# Altium project Larix_EDUV3b.PrjPcb
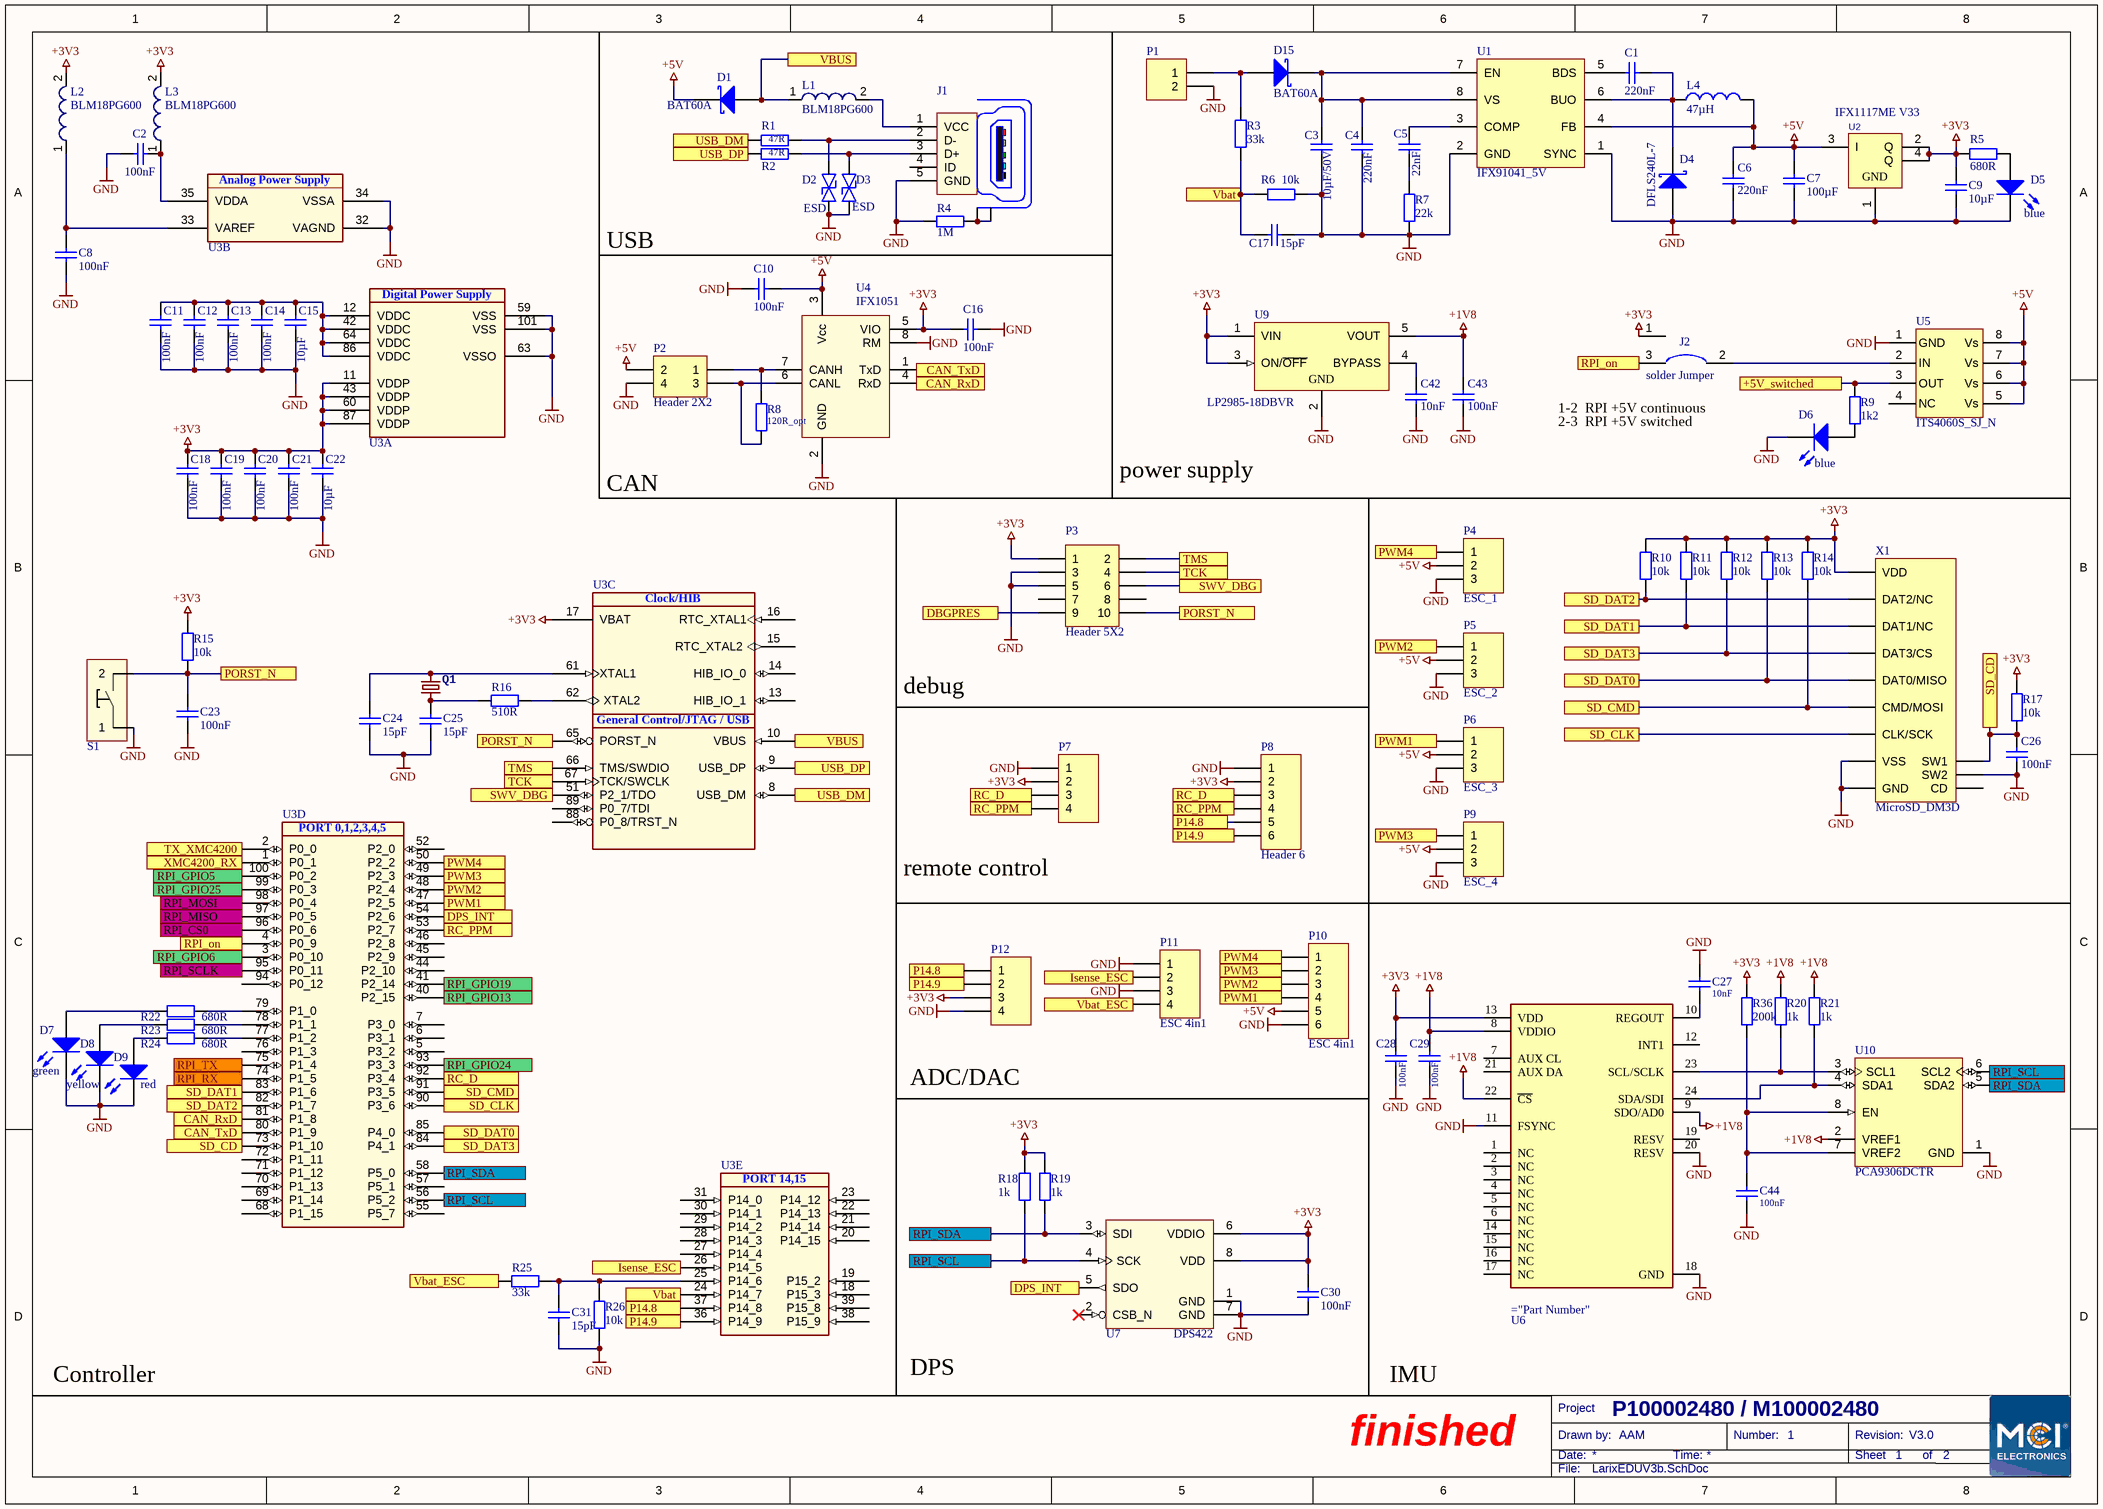
[diagram p0: LarixEDUV3b.SchDoc]
myProjectName: P100002480 / M100002480; myStatus: finished
2 sheets, 132 parts. Net scope: flat (ports and power ports of the same name join across sheets).
Board file: LarixEDUV3b.PcbDoc
Sheets:
  LarixEDUV3b.SchDoc
  LarixEDUV3b_1.SchDoc

## Sheet LarixEDUV3b.SchDoc: Larix EDU V2a
size A3; DrawnBy: AAM; Organization: MCI; DocumentNumber: 1; Revision: V3.0; SheetNumber: 1; SheetTotal: 2; ProjectName: M10000760

### Parts
C1  220nF  [_0603]
C2  100nF  [_0603]
C3  10µF/50V  [_1210]
C4  220nF  [_0603]
C5  22nF  [_0603]
C6  220nF  [_0603]
C7  100µF  [_1210]
C8  100nF  [_0603]
C9  10µF  [_0603]
C10  100nF  [_0603]
C11  100nF  [_0603]
C12  100nF  [_0603]
C13  100nF  [_0603]
C14  100nF  [_0603]
C15  10µF  [_0603]
C16  100nF  [_0603]
C17  15pF  [_0603]
C18  100nF  [_0603]
C19  100nF  [_0603]
C20  100nF  [_0603]
C21  100nF  [_0603]
C22  10µF  [_0603]
C23  100nF  [_0603]
C24  15pF  [_0603]
C25  15pF  [_0603]
C26  100nF  [_0603]
C27  10nF  [_0603]
C28  100nF  [_0603]
C29  100nF  [_0603]
C30  100nF  [_0603]
C31  15pF  [_0603]
C42  10nF  [_0603]
C43  100nF  [_0603]
C44  100nF  [_0603]
D1  BAT60A  [SOD-323]
D2  ESD  [TSLP_2_17]
D3  ESD  [TSLP_2_17]
D4  DFLS240L-7  [PowerDI_123]
D5  blue  [LED_0603]
D6  blue  [LED_0603]
D7  green  [LED_0603]
D8  yellow  [LED_0603]
D9  red  [LED_0603]
D15  BAT60A  [SOD-323]
J1  629105150921  [629105150921]  (value not drawn)
J2  solder Jumper  [Jumper_3pol]
L1  BLM18PG600  [SMD 0603]
L2  BLM18PG600  [SMD 0603]
L3  BLM18PG600  [SMD 0603]
L4  47µH  [WE_TCP]
P1  WRTBL_2P_508  [WRTBL_2P_508]  (value not drawn)
P2  Header 2X2  [HDR2X2]
P3  Header 5X2  [FTSH-105-01-F-D-K]
P4  ESC_1  [HDR1X3]
P5  ESC_2  [HDR1X3]
P6  ESC_3  [HDR1X3]
P7  STJ_SH_4pol  [SM04B-SRSS-TB(LF)(SN)]  (value not drawn)
P8  Header 6  [HDR1X6]
P9  ESC_4  [HDR1X3]
P10  ESC 4in1  [SM06B-SRSS-TB(LF)(SN)]
P11  ESC 4in1  [SM04B-SRSS-TB(LF)(SN)]
P12  STJ_SH_4pol  [SM04B-SRSS-TB(LF)(SN)]  (value not drawn)
Q1  12MHZ/S/3.2X2.5  [32X25_4PAD]  (value not drawn)
R1  47R  [_0603]
R2  47R  [_0603]
R3  33k  [_0603]
R4  1M  [_0603]
R5  680R  [_0603]
R6  10k  [_0603]
R7  22k  [_0603]
R8  120R_opt  [_0603]
R9  1k2  [_0603]
R10  10k  [_0603]
R11  10k  [_0603]
R12  10k  [_0603]
R13  10k  [_0603]
R14  10k  [_0603]
R15  10k  [_0603]
R16  510R  [_0603]
R17  10k  [_0603]
R18  1k  [_0603]
R19  1k  [_0603]
R20  1k  [_0603]
R21  1k  [_0603]
R22  680R  [_0603]
R23  680R  [_0603]
R24  680R  [_0603]
R25  33k  [_0603]
R26  10k  [_0603]
R36  200k  [_0603]
S1  Pushbutton_B3U-1000P  [B3U-1000P]  (value not drawn)
U1  IFX91041_5V  [DSO_8]
U2  IFX1117ME V33  [INF-PG-SOT223_SC-73_N]
U3  XMC4700-F100K2048  [QFP50P1600X1600X160-101N]  (value not drawn)  (parts A,B,C,D,E of 5)
U4  IFX1051  [PG-TSON-8]
U5  ITS4060S_SJ_N  [SO_8]
U6  ICM-20948  [TDK_InvenSense_ICM-20948_0]  (value not drawn)
U7  DPS422  [DPS310]
U9  LP2985-18DBVR  [DBV0005A_M]
U10  PCA9306DCTR  [DCT0008A_L]
X1  MicroSD_DM3D  [MicroSD_DM3D]

### Ports
+5V_switched, CAN_RxD, CAN_TxD, DBGPRES, DPS_INT, Isense_ESC, P14.8, P14.9, PORST_N, PWM1, PWM2, PWM3, PWM4, RC_D, RC_PPM, RPI_CS0, RPI_GPIO5, RPI_GPIO6, RPI_GPIO13, RPI_GPIO19, RPI_GPIO24, RPI_GPIO25, RPI_MISO, RPI_MOSI, RPI_on, RPI_RX (out), RPI_SCL, RPI_SCLK, RPI_SDA, RPI_TX (in), SD_CD, SD_CLK, SD_CMD, SD_DAT0, SD_DAT1, SD_DAT2, SD_DAT3, SWV_DBG, TCK, TMS, TX_XMC4200 (in), USB_DM, USB_DP, Vbat, Vbat_ESC, VBUS, XMC4200_RX (out)

### Nets
+1V8: C29.1 C43.1 R20.2 R21.2 U6.8(VDDIO) U6.9(SDO/AD0) U6.22(~{CS}) U9.5(VOUT) U10.2(VREF1)
+3V3: C9.2 C16.1 C18.1 C19.1 C20.1 C21.1 C22.1 C28.1 C30.1 J2.1 L2.2 L3.2 P3.1 P7.2 P8.2 P12.3 R5.1 R10.2 R11.2 R12.2 R13.2 R14.2 R15.2 R17.2 R18.2 R19.2 R36.2 U2.2(Q) U2.4(Q) U3.11(VDDP) U3.17(VBAT) U3.43(VDDP) U3.60(VDDP) U3.87(VDDP) U4.5(VIO) U6.13(VDD) U7.6(VDDIO) U7.8(VDD) U9.1(VIN) U9.3(ON/~{OFF}) X1.4(VDD)
+5V: C6.1 C7.2 C10.2 D1.1(K) L4.2 P2.2 P4.2 P5.2 P6.2 P9.2 P10.5 U1.4(FB) U2.3(I) U4.3(Vcc) U5.5(Vs) U5.6(Vs) U5.7(Vs) U5.8(Vs)
GND: C2.1 C3.1 C4.2 C6.2 C7.1 C8.2 C9.1 C10.1 C11.2 C12.2 C13.2 C14.2 C15.2 C16.2 C17.1 C18.2 C19.2 C20.2 C21.2 C22.2 C23.2 C24.1 C25.2 C26.2 C27.1 C28.2 C29.2 C30.2 C31.2 C42.2 C43.2 C44.2 D2.1 D3.1 D4.1(A) D5.2 D6.2 D7.2 D8.2 D9.2 J1.5(GND) P1.2 P2.4 P3.3 P3.5 P4.3 P5.3 P6.3 P7.1 P8.1 P9.3 P10.6 P11.1 P11.3 P12.4 R4.1 R6.2 R7.1 R26.1 S1.1 U1.1(SYNC) U1.2(GND) U2.1(GND) U3.32(VAGND) U3.34(VSSA) U3.59(VSS) U3.63(VSSO) U3.101(VSS) U4.2(GND) U4.8(RM) U5.1(GND) U6.11(FSYNC) U6.18(GND) U6.20(RESV) U7.1(GND) U7.7(GND) U9.2(GND) U10.1(GND) X1.6(VSS) X1.GND X1.SW2
NetC1_1: C1.1 U1.5(BDS)
NetC1_2: C1.2 D4.2(K) L4.1 U1.6(BUO)
NetC2_2: C2.2 L3.1 U3.35(VDDA)
NetC3_2: C3.2 C4.1 D15.1(K) U1.7(EN) U1.8(VS)
NetC5_1: C5.1 U1.3(COMP)
NetC5_2: C5.2 R7.2
NetC8_1: C8.1 L2.1 U3.33(VAREF)
NetC11_1: C11.1 C12.1 C13.1 C14.1 C15.1 U3.12(VDDC) U3.42(VDDC) U3.64(VDDC) U3.86(VDDC)
NetC17_2: C17.2 R3.1 R6.1 U3.24(P14_7) ; port Vbat
NetC23_1: C23.1 P3.10 R15.1 S1.2 U3.65(PORST_N) ; port PORST_N
NetC24_2: C24.2 Q1.1 U3.61(XTAL1)
NetC25_1: C25.1 Q1.3 R16.2
NetC26_1: C26.1 R17.1 U3.73(P1_10) X1.SW1 ; port SD_CD
NetC27_2: C27.2 U6.10(REGOUT)
NetC31_1: C31.1 R25.2 R26.2 U3.25(P14_6)
NetC42_1: C42.1 U9.4(BYPASS)
NetC44_1: C44.1 R36.1 U10.7(VREF2) U10.8(EN)
NetD1_2: D1.2(A) L1.1 U3.10(VBUS) ; port VBUS
NetD2_2: D2.2 J1.2(D-) R1.2
NetD3_2: D3.2 J1.3(D+) R2.2
NetD5_1: D5.1 R5.2
NetD6_1: D6.1 R9.1
NetD7_1: D7.1 R22.2
NetD8_1: D8.1 R23.2
NetD9_1: D9.1 R24.2
NetD15_2: D15.2(A) P1.1 R3.2
NetJ1_1: J1.1(VCC) L1.2
NetJ1_Z1: J1.Z1(Shield) J1.Z2(Shield) R4.2
NetJ2_2: J2.2 U5.2(IN)
NetJ2_3: J2.3 U3.4(P0_9) ; port RPI_on
NetP2_1: P2.1 R8.2 U4.7(CANH)
NetP2_3: P2.3 R8.1 U4.6(CANL)
NetP3_2: P3.2 U3.66(TMS/SWDIO) ; port TMS
NetP3_4: P3.4 U3.67(TCK/SWCLK) ; port TCK
NetP3_6: P3.6 U3.51(P2_1/TDO) ; port SWV_DBG
NetP3_9: P3.9 ; port DBGPRES
NetP4_1: P4.1 P10.1 U3.50(P2_2) ; port PWM4
NetP5_1: P5.1 P10.3 U3.48(P2_4) ; port PWM2
NetP6_1: P6.1 P10.4 U3.47(P2_5) ; port PWM1
NetP7_3: P7.3 P8.3 U3.92(P3_4) ; port RC_D
NetP7_4: P7.4 P8.4 U3.53(P2_7) ; port RC_PPM
NetP8_5: P8.5 P12.1 U3.37(P14_8) ; port P14.8
NetP8_6: P8.6 P12.2 U3.36(P14_9) ; port P14.9
NetP9_1: P9.1 P10.2 U3.49(P2_3) ; port PWM3
NetP11_2: P11.2 U3.26(P14_5) ; port Isense_ESC
NetP11_4: P11.4 R25.1 ; port Vbat_ESC
NetP13_2: R9.2 U5.3(OUT) ; port +5V_switched
NetP13_3: R19.1 U3.58(P5_0) U7.3(SDI) U10.5(SDA2) ; port RPI_SDA
NetP13_5: R18.1 U3.56(P5_2) U7.4(SCK) U10.6(SCL2) ; port RPI_SCL
NetP13_8: U3.75(P1_4) ; port RPI_TX
NetP13_10: U3.74(P1_5) ; port RPI_RX
NetP13_18: U3.93(P3_3) ; port RPI_GPIO24
NetP13_19: U3.98(P0_4) ; port RPI_MOSI
NetP13_21: U3.97(P0_5) ; port RPI_MISO
NetP13_22: U3.99(P0_3) ; port RPI_GPIO25
NetP13_23: U3.95(P0_11) ; port RPI_SCLK
NetP13_24: U3.96(P0_6) ; port RPI_CS0
NetP13_29: U3.100(P0_2) ; port RPI_GPIO5
NetP13_31: U3.3(P0_10) ; port RPI_GPIO6
NetP13_33: U3.40(P2_15) ; port RPI_GPIO13
NetP13_35: U3.41(P2_14) ; port RPI_GPIO19
NetR1_1: R1.1 U3.8(USB_DM) ; port USB_DM
NetR2_1: R2.1 U3.9(USB_DP) ; port USB_DP
NetR10_1: R10.1 U3.82(P1_7) X1.1(DAT2/NC) ; port SD_DAT2
NetR11_1: R11.1 U3.83(P1_6) X1.8(DAT1/NC) ; port SD_DAT1
NetR12_1: R12.1 U3.84(P4_1) X1.2(DAT3/CS) ; port SD_DAT3
NetR13_1: R13.1 U3.85(P4_0) X1.7(DAT0/MISO) ; port SD_DAT0
NetR14_1: R14.1 U3.91(P3_5) X1.3(CMD/MOSI) ; port SD_CMD
NetR16_1: R16.1 U3.62(XTAL2)
NetR20_1: R20.1 U6.23(SCL/SCLK) U10.3(SCL1)
NetR21_1: R21.1 U6.24(SDA/SDI) U10.4(SDA1)
NetR22_1: R22.1 U3.79(P1_0)
NetR23_1: R23.1 U3.78(P1_1)
NetR24_1: R24.1 U3.77(P1_2)
NetU3_1: U3.1(P0_1) ; port XMC4200_RX
NetU3_2: U3.2(P0_0) ; port TX_XMC4200
NetU3_54: U3.54(P2_6) U7.5(SDO) ; port DPS_INT
NetU3_80: U3.80(P1_9) U4.1(TxD) ; port CAN_TxD
NetU3_81: U3.81(P1_8) U4.4(RxD) ; port CAN_RxD
NetU3_90: U3.90(P3_6) X1.5(CLK/SCK) ; port SD_CLK

Not connected (* = marked no-connect by the designer): J1 4(ID); P3 7 8; U3 5(P3_2) 6(P3_1) 7(P3_0) 13(HIB_IO_1) 14(HIB_IO_0) 15(RTC_XTAL2) 16(RTC_XTAL1) 18(P15_3) 19(P15_2) 20(P14_15) 21(P14_14) 22(P14_13) 23(P14_12) 27(P14_4) 28(P14_3) 29(P14_2) 30(P14_1) 31(P14_0) 38(P15_9) 39(P15_8) 44(P2_10) 45(P2_9) 46(P2_8) 52(P2_0) 55(P5_7) 57(P5_1) 68(P1_15) 69(P1_14) 70(P1_13) 71(P1_12) 72(P1_11) 76(P1_3) 88(P0_8/TRST_N) 89(P0_7/TDI) 94(P0_12); U5 4(NC); U6 1(NC) 2(NC) 3(NC) 4(NC) 5(NC) 6(NC) 7(AUX_CL) 12(INT1) 14(NC) 15(NC) 16(NC) 17(NC) 19(RESV) 21(AUX_DA); U7 2(CSB_N)*; X1 CD

### Notes on the sheet
- USB
- (near J2) 1-2  RPI +5V continuous
- (near J2) 2-3  RPI +5V switched
- CAN
- power supply
- debug
- (near P7) remote control
- ADC/DAC
- Controller
- DPS
- IMU
- Project
- Date:
- Drawn by:
- Time:
- Number:
- Revision:
- Sheet
- of
- ELECTRONICS
- File:
- (in symbol IC_116, part A) Digital Power Supply
- (in symbol IC_116, part B) Analog Power Supply
- (in symbol IC_116, part C) Clock/HIB; General Control/JTAG / USB
- (in symbol IC_116, part D) PORT 0,1,2,3,4,5
- (in symbol IC_116, part E) PORT 14,15

### Library data of the parts
C1 C2 C4-C6 C8-C31 C42-C44 = Cap_129: Name: Cap_0603; QR: 0; UID: Cap_129; mounting: SMD
C3 C7 = Cap_65: Name: Cap_1210; Capacity: ?F; Voltage: ?V; UID: Cap_65; mounting: SMD
D1 D15 = BAT60A: Silicon AF Schottky Rectifier Diode with Extreme Low VF Drop; Published: 21-Mar-2003; LatestRevisionDate: 19-Mar-2004; LatestRevisionNote: Silkscreen size reduced.; DatasheetDocument: Jan-1999; PackageDocument: Sep-2000; PackageReference: SOD-323; Publisher: Altium Limited; ComponentLink1Description: Manufacturer Link; ComponentLink1URL: http://www.infineon.com/; ComponentLink2Description: Datasheet; ComponentLink2URL: http://www.infineon.com/upload/Document/cmc_upload/documents/081/715/bat60aseries_1.pdf
D2 D3 = DIODE_69: ESD101-B1-02ELS _E6327; UID: DIODE_69; Name: ESD; mounting: SMD
D4 = DIODE_68: Type: Schottky; UID: DIODE_68; Name: DFLS240L-7; mounting: SMD
D5-D9 = DIODE_61: Name: LED_0603_gruen; Colour: gruen; RS_number: 697-3715P; QR: 0; UID: DIODE_61; Type: LED; Name_Hyperlink: http://at.rs-online.com/web/p/products/6973715P/; mounting: SMD
J1 = 629105150921: WR-COM_USB_Micro Type AB_Horizontal_SMT; Manufacturer: Würth Elektronik eiSos GmbH; ComponentLink1 Description: Manufacturer; ComponentLink2 Description: Datasheet; NoPins: 5; ComponentLink1URL: http://www.we-online.de; ComponentLink2URL: http://katalog.we-online.de/em/datasheet/629105150921.pdf; Created by: Karrer Zheng; Created Date: 10/23/2014; partNo: 629105150921
J2 = Con_71: UID: Con_71; Name: Jumper_3pol; mounting: SMD
L1-L3 = WE-CBF 0603, 74279260: SMD EMI Suppression Ferrite Beads WE-CBF, Z= 40 Ohm; Manufacturer: Würth Elektronik eiSos GmbH; Impedance: 40 Ohm; ComponentLink1Description: Manufacturer; ComponentLink1URL: http://www.we-online.de; Created by: Christin Zierenner; Created Date: May 2009; partNo: 74279260; ComponentLink2Description: Datasheet; ComponentLink2URL: http://www.we-online.de/katalog/media/pdf/74279260.pdf
L4 = Ind_42: Inductor; Name: IND_4u7_1A72; RS_number: 617-0925; Wuerth_number: 744042004; QR: 0; Inductivity: 4u7; Current: 1.72; UID: Ind_42; Name_Hyperlink: http://at.rs-online.com/web/p/drahtgewickelte-smd-induktivitaten/6170925/; ComponentLink1URL: http://at.rs-online.com/web/p/drahtgewickelte-smd-induktivitaten/6170925/; mounting: SMD
P1 = Con_7: RS_number: 193-0586; QR: 0; UID: Con_7; Name: WRTBL_2P_508; Name_Hyperlink: Printklemme 5,08mm 2-polig; ComponentLink1URL: http://at.rs-online.com/web/search/searchBrowseAction.html?method=getProduct&R=1930586; mounting: THT; Pins: 2
P2 = Con_45: QR: 0; UID: Con_45; Name: Header 2X2; mounting: THT; Pins: 2X2
P3 = Header 5X2: Header, 5-Pin, Dual row; LatestRevisionDate: 17-Jul-2002; LatestRevisionNote: Re-released for DXP Platform.; Publisher: Altium Limited
P4-P6 P9 = Con_33: QR: 0; UID: Con_33; Name: Header 3; mounting: THT; Pins: 1X3
P7 P12 = Con_80: UID: Con_80; Name: STJ_SH_4pol; mounting: SMD
P8 = Con_36: QR: 0; UID: Con_36; Name: Header 6; mounting: THT; Pins: 1X6
P10 = Con_82: Name: STJ_SH_06pol; UID: Con_82; mounting: SMD
P11 = Con_80: Name: STJ_SH_4pol; UID: Con_80; mounting: SMD
Q1 = NX3225_2
R1-R26 R36 = Res_5: Name: Res_0603; UID: Res_5; mounting: SMD
  R5 R9-R14 R17: ComponentLink1URL: #WERT!
S1 = Misc_47: RS_number: 419-867; UID: Misc_47; Name: Pushbutton_B3U-1000P; Name_Hyperlink: https://at.rs-online.com/web/p/products/419867; ComponentLink1URL: https://at.rs-online.com/web/p/products/419867; mounting: SMD
U1 = Source_52: UID: Source_52; Name: IFX91041; mounting: SMD
U2 = IFX1117ME V33: Voltage Regulator, 4.55 to 15 V Operating, 1000 mA, -40 to 125 degC, PG-SOT223 (SC-73), Reel, Green; Manufacturer: Infineon; Accuracy: 2.0 %; Automotive Qualified: FALSE; Dropout Voltage: 1200 mV; Green: TRUE; Max Number Reflow: 3; Max Peak Reflow Temp: 260 degC; Max. Output Current: 1000 mA; Output Voltage: 3.3 V; Regulator Type: Linear->single output; Typical Quiescent Current: 5000 uA; DatasheetVersion: Rev. 1.0; PackageVersion: Apr-08; PackageReference: PG-SOT223 (SC-73); PackageDescription: 4-Pin Small Outline Transistor Package, 6.5 x 3.5 mm Body, 2.3 mm Pitch; Supplier 1: Mouser; Supplier Part Number 1: 726-IFX1117MEV33; Supplier 2: Digi-Key; Supplier Part Number 2: IFX1117ME V33TR-ND; Supplier 3: Digi-Key; Supplier Part Number 3: IFX1117ME V33CT-ND; Supplier 4: Digi-Key; Supplier Part Number 4: IFX1117ME V33DKR-ND; MSL: 1; Packing: Reel; Reset: FALSE; Status Output: FALSE; Mounting Technology: Surface Mount; PartNumber: IFX1117ME V33; ComponentLink1Description: Manufacturer URL; ComponentLink1URL: http://www.infineon.com/; ComponentLink2Description: Datasheet; ComponentLink2URL: http://www.infineon.com/dgdl/IFX1117ME+V33.pdf?folderId=db3a304318f3fe290118f5a433570040&fileId=db3a30432e779412012e9097d1611987; ComponentLink3Description: Package Specification; ComponentLink3URL: http://www.infineon.com/dgdl/SOT223-Package_Overview.pdf?folderId=db3a30431936bc4b0119530470b03c3d&fileId=db3a30431936bc4b0119531d40b93c5c
U3 = IC_116: XMC4000 Family Microcontroller for Industrial Applications, ARM® Cortex™-M4, 32-bit processor coreFlash 2048 Kbytes,SRAM 352 Kbytes (Temperature Range -40°C to 125°C); Manufacturer: Infineon Technologies; ManufacturerPartNumber: XMC4700-F100K2048; PackageReference: PG-LQFP-100-11; UID: IC_116; Name: XMC4700-F100K2048; mounting: SMD
U4 = IC_117: UID: IC_117; Name: IFX1051; mounting: SMD
U5 = IC_102: RS_number: 110-7158; UID: IC_102; Name: ITS4060S_SJ_N; Name_Hyperlink: https://at.rs-online.com/web/p/intelligente-leistungsschalter/1107158/?searchTerm=ITS4060S-SJ-N&relevancy-data=636F3D3226696E3D4931384E4B6E6F776E41734D504E266C753D6465266D6D3D6D61746368616C6C7061727469616C26706D3D5E5B5C707B4C7D5C707B4E647D2D2C2F255C2E5D2B; ComponentLink1URL: https://at.rs-online.com/web/p/intelligente-leistungsschalter/1107158/?searchTerm=ITS4060S-SJ-N&relevancy-data=636F3D3226696E3D4931384E4B6E6F776E41734D504E266C753D6465266D6D3D6D61746368616C6C7061727469616C26706D3D5E5B5C707B4C7D5C707B4E647D2D2C2F255C2E5D2B; IC_description: https://www.infineon.com/dgdl/Infineon-ITS4060S_SJ_N_01092012S-DS-v01_00-en.pdf?fileId=db3a304339dcf4b1013a0137d230573b; mounting: SMD
U7 = IC_107: Digital Barometric Pressure Sensor for Portable Devices; Manufacturer: Infineon Technologies; ManufacturerPartNumber: DPS310; PackageReference: LGA-8; UID: IC_107; Name: DPS422; mounting: SMD
U9 = LP2985-18DBVR: Single Output Low Noise LDO, 150 mA, Fixed 1.8 V Output, 1.5% Tolerance, 2.2 to 16 V Input, Low IQ, 5-Pin SOT-23 (DBV), -40 to 125 degC, Green (RoHS & no Sb/Br), Tape and Reel; Manufacturer: Texas Instruments; Vdo (Typ) (mV): 280; Output Options: Fixed Output; Iout (Max) (A): 0.15; Fixed Output Options (V): 1.8; Iq (Typ) (mA): 0.85; Accuracy (%): 1.5; Operating Temperature Range (degC): -40 to 125; PartNumber: LP2985-18DBVR; ComponentLink1Description: Manufacturer URL; ComponentLink2Description: Datasheet; DatasheetVersion: SLVS522N; ComponentLink3URL: http://www.ti.com/litv/pdf/mpds018j; ComponentLink1URL: http://www.ti.com/; Packing: Tape and Reel; ComponentLink2URL: http://www.ti.com/lit/ds/symlink/lp2985-50.pdf; ComponentLink3Description: Package Specification; PackageVersion: 4073253-4/L; RoHS: TRUE; Mounting Technology: Surface Mount; PackageReference: DBV0005A; PackageDescription: 5-Pin Plastic Small Outline, Body 2.9 x 1.6 mm, Pitch 0.95 mm; Vin (V): 2.2 to 16
U10 = PCA9306DCTR: Dual Bi-Directional I2C-Bus and SMBus Voltage Level-Translator, 0 to 5.5 V, -40 to 85 degC, 8-pin SM8 (DCT), Green (RoHS & no Sb/Br); Manufacturer: Texas Instruments; SubFamily: I2C Special Function; Function: Voltage Translator; fSCLK(Max)(MHz): 400; Open Drain I/O Type: Yes; No. of Outputs: 2; Vcc range(V): 0 to 5.5; Rating: Catalog; tpd max(ns): 1.5; Eco-Plan: Green (RoHS & no Sb/Br); PartNumber: PCA9306DCTR; ComponentLink1Description: Datasheet; ComponentLink2Description: Package Specification; ComponentLink1URL: http://www.ti.com/general/docs/lit/getliterature.tsp?genericPartNumber=PCA9306&fileType=pdf; Code_JEDEC: MO-187-DA; ComponentLink2URL: http://www.ti.com/litv/pdf/mpds049b; Enable Pin: Yes; 5V Tolerant I/O: Yes; On-Chip Power-on-Reset: No; PackageVersion: revC, Sep-2002; Max Frequency(kHz): 400; DatasheetVersion: SCPS113J; Mounting Technology: Surface Mount; PackageReference: DCT0008A; PackageDescription: 8-Pin Thin Small Outline Package 3 x 2.8 mm Body ,0.65 mm Pitch
X1 = Misc_48: CONN MICRO SD CARD PUSH-PUSH R/A; RS_number: 738-8809; Supplier 1: Digi-Key; Supplier Part Number 1: 101-00660-68-6-1-ND; UID: Misc_48; Name: MicroSD_DM3D; Name_Hyperlink: https://at.rs-online.com/web/p/speicher-und-sim-karten-steckverbinder/7388809/; mounting: SMD

## Sheet LarixEDUV3b_1.SchDoc: Larix EDU V3
size A3; DrawnBy: AAM; Organization: MCI; DocumentNumber: 1; Revision: V3.0; SheetNumber: 2; SheetTotal: 2; ProjectName: M10000760
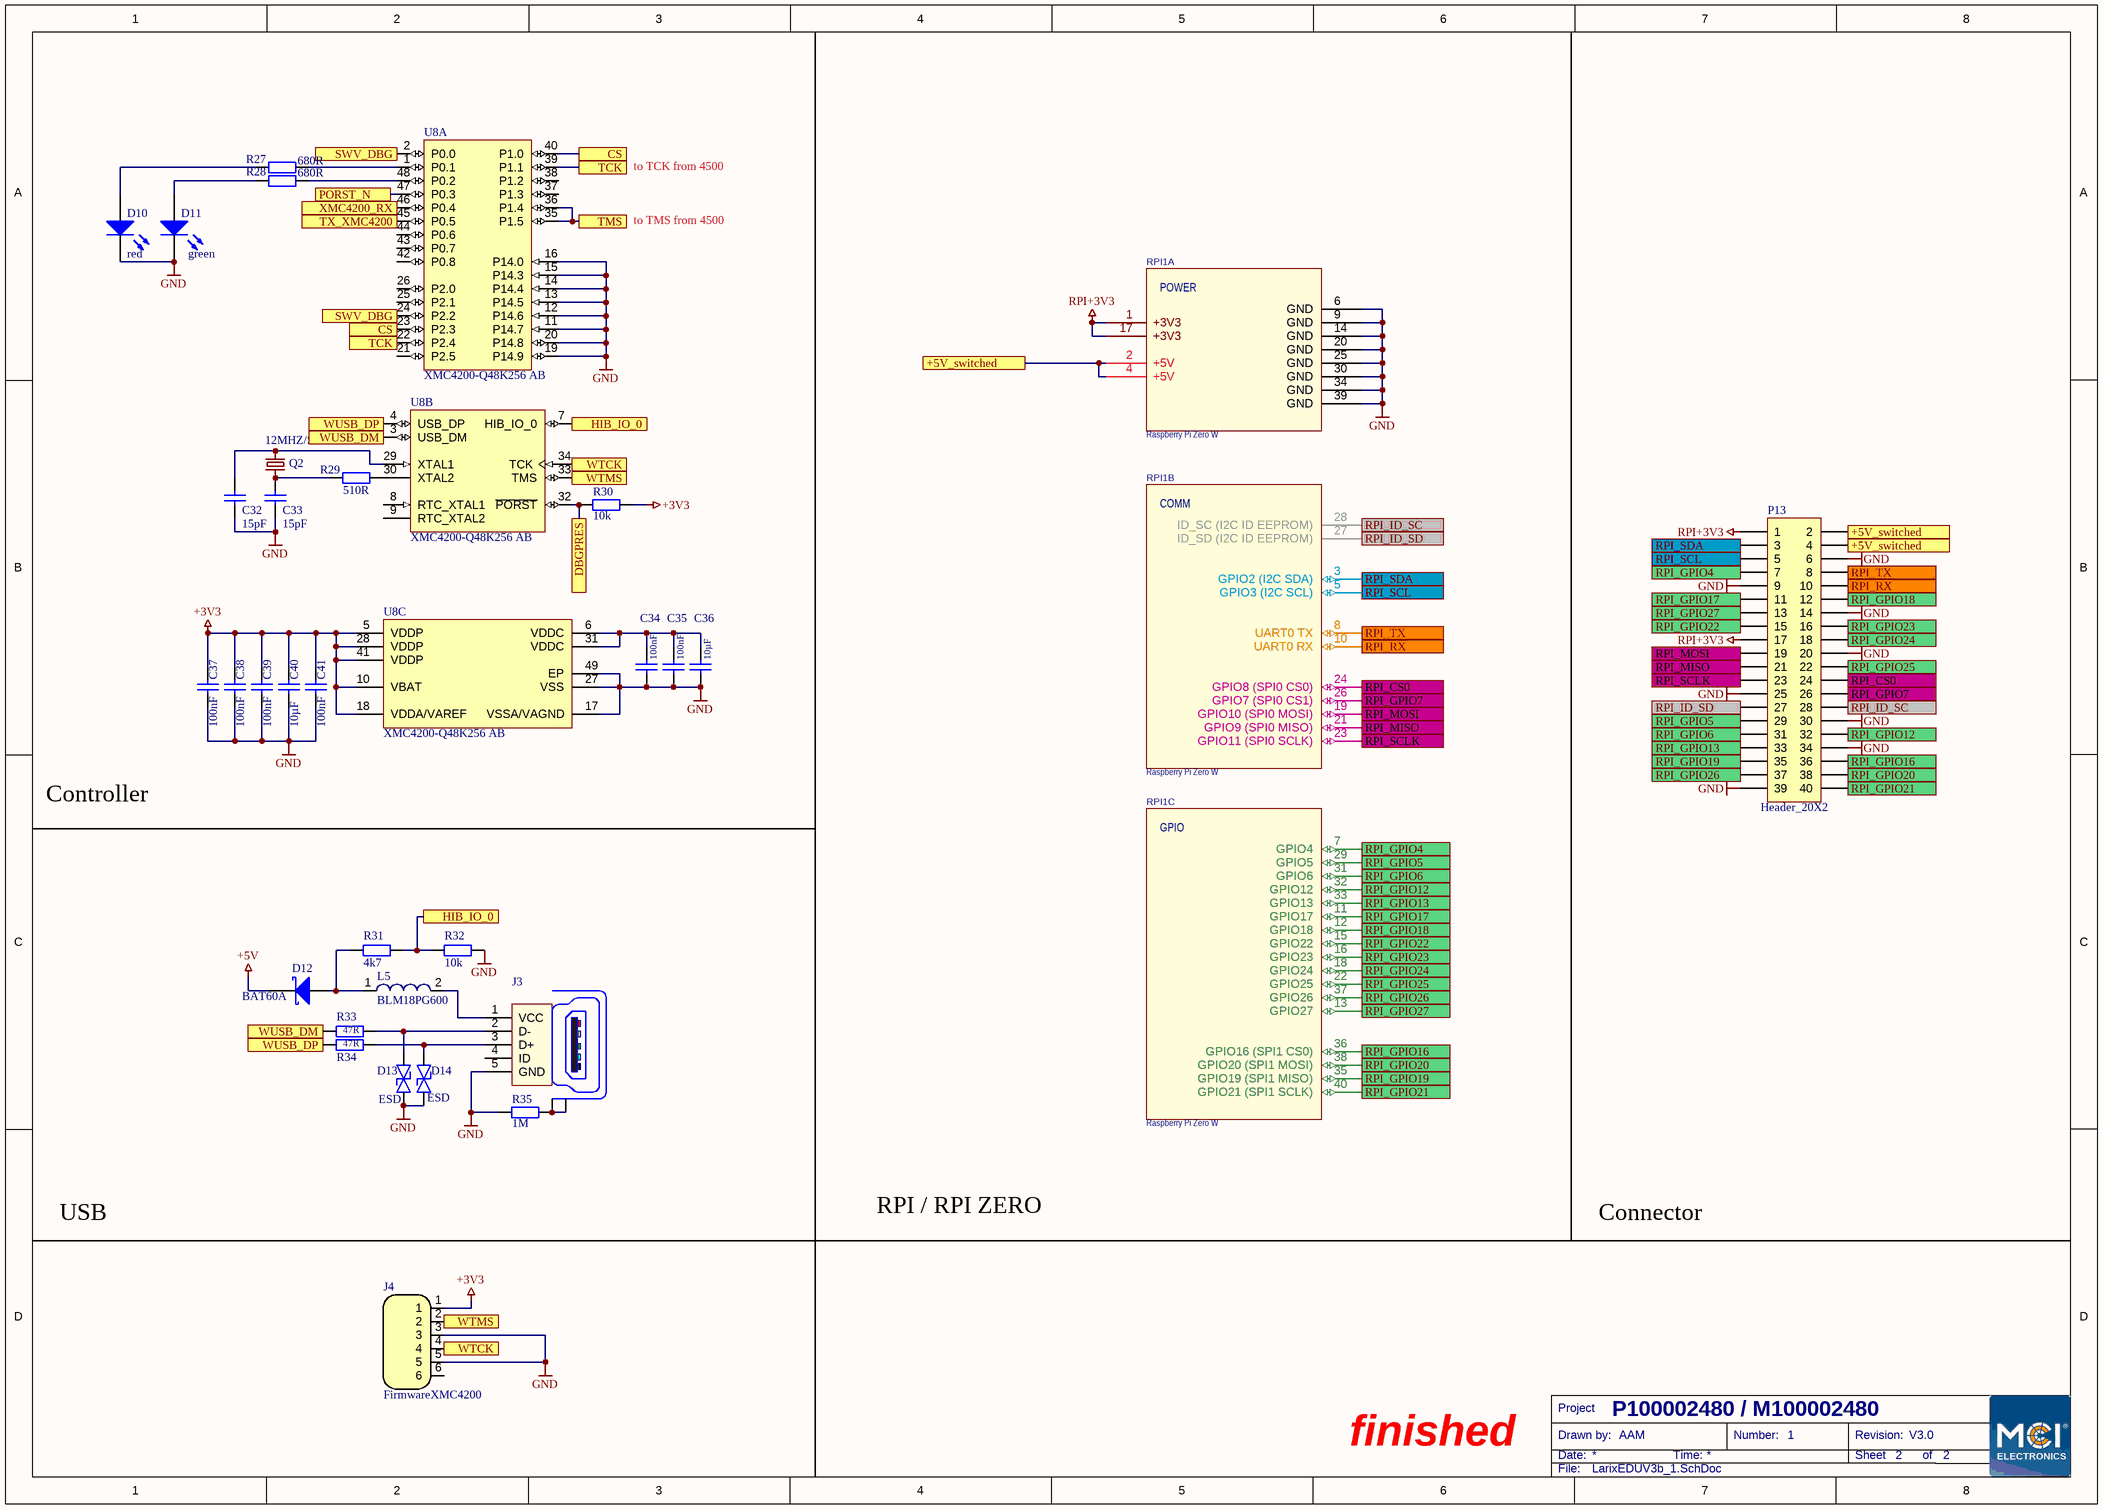
[diagram p1: LarixEDUV3b_1.SchDoc]

### Parts
C32  15pF  [_0603]
C33  15pF  [_0603]
C34  100nF  [_0603]
C35  100nF  [_0603]
C36  10µF  [_0603]
C37  100nF  [_0603]
C38  100nF  [_0603]
C39  100nF  [_0603]
C40  10µF  [_0603]
C41  100nF  [_0603]
D10  red  [LED_0603]
D11  green  [LED_0603]
D12  BAT60A  [SOD-323]
D13  ESD  [TSLP_2_17]
D14  ESD  [TSLP_2_17]
J3  629105150921  [629105150921]  (value not drawn)
J4  FirmwareXMC4200  [TagConnect_6pol]  (no BOM)
L5  BLM18PG600  [SMD 0603]
P13  Header_20X2  [Header_20X2]
Q2  12MHZ/S/3.2X2.5  [32X25_4PAD]
R27  680R  [_0603]
R28  680R  [_0603]
R29  510R  [_0603]
R30  10k  [_0603]
R31  4k7  [_0603]
R32  10k  [_0603]
R33  47R  [_0603]
R34  47R  [_0603]
R35  1M  [_0603]
RPI1  Raspberry Pi Zero W  [RPI_ZERO]  (parts A,B,C of 3)
U8  XMC4200-Q48K256 AB  [INF-PG-VQFN-48-53-5200X5200TP_N]  (parts A,B,C of 3)

### Ports
+5V_switched, CS, DBGPRES, HIB_IO_0, PORST_N, RPI_CS0, RPI_GPIO4, RPI_GPIO5, RPI_GPIO6, RPI_GPIO7, RPI_GPIO12, RPI_GPIO13, RPI_GPIO16, RPI_GPIO17, RPI_GPIO18, RPI_GPIO19, RPI_GPIO20, RPI_GPIO21, RPI_GPIO22, RPI_GPIO23, RPI_GPIO24, RPI_GPIO25, RPI_GPIO26, RPI_GPIO27, RPI_ID_SC, RPI_ID_SD, RPI_MISO, RPI_MOSI, RPI_RX (in), RPI_SCL, RPI_SCLK, RPI_SDA, RPI_TX (out), SWV_DBG, TCK, TMS, TX_XMC4200 (out), WTCK, WTMS, WUSB_DM, WUSB_DP, XMC4200_RX (in)

### Nets
+3V3: C37.2 C38.2 C39.2 C40.2 C41.2 J4.1 R30.1 U8.5(VDDP) U8.10(VBAT) U8.18(VDDA/VAREF) U8.28(VDDP) U8.41(VDDP)
+5V: D12.1(K)
GND: C32.1 C33.1 C34.1 C35.1 C36.1 C37.1 C38.1 C39.1 C40.1 C41.1 D10.2 D11.2 D13.1 D14.1 J3.5(GND) J4.3 J4.5 P13.6 P13.9 P13.14 P13.20 P13.25 P13.30 P13.34 P13.39 R32.2 R35.1 RPI1.6(GND) RPI1.9(GND) RPI1.14(GND) RPI1.20(GND) RPI1.25(GND) RPI1.30(GND) RPI1.34(GND) RPI1.39(GND) U8.11(P14.7) U8.12(P14.6) U8.13(P14.5) U8.14(P14.4) U8.15(P14.3) U8.16(P14.0) U8.17(VSSA/VAGND) U8.19(P14.9) U8.20(P14.8) U8.27(VSS) U8.49(EP)
RPI+3V3: P13.1 P13.17 RPI1.1(+3V3) RPI1.17(+3V3)
NetC23_1: U8.47(P0.3) ; port PORST_N
NetC32_2: C32.2 Q2.3 U8.29(XTAL1)
NetC33_2: C33.2 Q2.1 R29.1
NetC34_2: C34.2 C35.2 C36.2 U8.6(VDDC) U8.31(VDDC)
NetD10_1: D10.1 R27.1
NetD11_1: D11.1 R28.1
NetD12_2: D12.2(A) L5.1 R31.1
NetD13_2: D13.2 J3.2(D-) R33.2
NetD14_2: D14.2 J3.3(D+) R34.2
NetJ3_1: J3.1(VCC) L5.2
NetJ3_Z1: J3.Z1(Shield) J3.Z2(Shield) R35.2
NetJ4_2: J4.2 U8.33(TMS) ; port WTMS
NetJ4_4: J4.4 U8.34(TCK) ; port WTCK
NetP3_2: U8.35(P1.5) U8.36(P1.4) ; port TMS
NetP3_4: U8.22(P2.4) U8.39(P1.1) ; port TCK
NetP3_6: U8.2(P0.0) U8.24(P2.2) ; port SWV_DBG
NetP3_9: R30.2 U8.32(~{PORST}) ; port DBGPRES
NetP13_2: P13.2 P13.4 RPI1.2(+5V) RPI1.4(+5V) ; port +5V_switched
NetP13_3: P13.3 RPI1.3(GPIO2_(I2C_SDA)) ; port RPI_SDA
NetP13_5: P13.5 RPI1.5(GPIO3_(I2C_SCL)) ; port RPI_SCL
NetP13_7: P13.7 RPI1.7(GPIO4) ; port RPI_GPIO4
NetP13_8: P13.8 RPI1.8(UART0_TX) ; port RPI_TX
NetP13_10: P13.10 RPI1.10(UART0_RX) ; port RPI_RX
NetP13_11: P13.11 RPI1.11(GPIO17) ; port RPI_GPIO17
NetP13_12: P13.12 RPI1.12(GPIO18) ; port RPI_GPIO18
NetP13_13: P13.13 RPI1.13(GPIO27) ; port RPI_GPIO27
NetP13_15: P13.15 RPI1.15(GPIO22) ; port RPI_GPIO22
NetP13_16: P13.16 RPI1.16(GPIO23) ; port RPI_GPIO23
NetP13_18: P13.18 RPI1.18(GPIO24) ; port RPI_GPIO24
NetP13_19: P13.19 RPI1.19(GPIO10_(SPI0_MOSI)) ; port RPI_MOSI
NetP13_21: P13.21 RPI1.21(GPIO9_(SPI0_MISO)) ; port RPI_MISO
NetP13_22: P13.22 RPI1.22(GPIO25) ; port RPI_GPIO25
NetP13_23: P13.23 RPI1.23(GPIO11_(SPI0_SCLK)) ; port RPI_SCLK
NetP13_24: P13.24 RPI1.24(GPIO8_(SPI0_CS0)) ; port RPI_CS0
NetP13_26: P13.26 RPI1.26(GPIO7_(SPI0_CS1)) ; port RPI_GPIO7
NetP13_27: P13.27 RPI1.27(ID_SD_(I2C_ID_EEPROM)) ; port RPI_ID_SD
NetP13_28: P13.28 RPI1.28(ID_SC_(I2C_ID_EEPROM)) ; port RPI_ID_SC
NetP13_29: P13.29 RPI1.29(GPIO5) ; port RPI_GPIO5
NetP13_31: P13.31 RPI1.31(GPIO6) ; port RPI_GPIO6
NetP13_32: P13.32 RPI1.32(GPIO12) ; port RPI_GPIO12
NetP13_33: P13.33 RPI1.33(GPIO13) ; port RPI_GPIO13
NetP13_35: P13.35 RPI1.35(GPIO19_(SPI1_MISO)) ; port RPI_GPIO19
NetP13_36: P13.36 RPI1.36(GPIO16_(SPI1_CS0)) ; port RPI_GPIO16
NetP13_37: P13.37 RPI1.37(GPIO26) ; port RPI_GPIO26
NetP13_38: P13.38 RPI1.38(GPIO20_(SPI1_MOSI)) ; port RPI_GPIO20
NetP13_40: P13.40 RPI1.40(GPIO21_(SPI1_SCLK)) ; port RPI_GPIO21
NetR27_2: R27.2 U8.1(P0.1)
NetR28_2: R28.2 U8.48(P0.2)
NetR29_2: R29.2 U8.30(XTAL2)
NetR31_2: R31.2 R32.1 U8.7(HIB_IO_0) ; port HIB_IO_0
NetR33_1: R33.1 U8.3(USB_DM) ; port WUSB_DM
NetR34_1: R34.1 U8.4(USB_DP) ; port WUSB_DP
NetU3_1: U8.46(P0.4) ; port XMC4200_RX
NetU3_2: U8.45(P0.5) ; port TX_XMC4200
NetU8_23: U8.23(P2.3) U8.40(P1.0) ; port CS

Not connected (* = marked no-connect by the designer): J3 4(ID); J4 6; U8 8(RTC_XTAL1) 9(RTC_XTAL2) 21(P2.5) 25(P2.1) 26(P2.0) 37(P1.3) 38(P1.2) 42(P0.8) 43(P0.7) 44(P0.6)

### Notes on the sheet
- to TCK from 4500
- to TMS from 4500
- Controller
- USB
- RPI / RPI ZERO
- Connector
- Project
- Date:
- Drawn by:
- Time:
- Number:
- Revision:
- Sheet
- of
- ELECTRONICS
- File:
- (in symbol Misc_46, part A) POWER
- (in symbol Misc_46, part B) COMM
- (in symbol Misc_46, part C) GPIO

### Library data of the parts
C32-C41 = Cap_129: Name: Cap_0603; QR: 0; UID: Cap_129; mounting: SMD
D10 D11 = DIODE_61: as D5 on sheet LarixEDUV3b; UID: DIODE_61; Type: LED; Name_Hyperlink: http://at.rs-online.com/web/p/products/6973715P/; mounting: SMD
D12 = BAT60A: as D1 on sheet LarixEDUV3b; Published: 21-Mar-2003; LatestRevisionDate: 19-Mar-2004; LatestRevisionNote: Silkscreen size reduced.; DatasheetDocument: Jan-1999; PackageDocument: Sep-2000; PackageReference: SOD-323; Publisher: Altium Limited; ComponentLink1Description: Manufacturer Link; ComponentLink1URL: http://www.infineon.com/; ComponentLink2Description: Datasheet; ComponentLink2URL: http://www.infineon.com/upload/Document/cmc_upload/documents/081/715/bat60aseries_1.pdf
D13 D14 = DIODE_69: ESD101-B1-02ELS _E6327; UID: DIODE_69; Name: ESD; mounting: SMD
J3 = 629105150921: as J1 on sheet LarixEDUV3b; ComponentLink1URL: http://www.we-online.de; ComponentLink2URL: http://katalog.we-online.de/em/datasheet/629105150921.pdf; Created by: Karrer Zheng; Created Date: 10/23/2014; partNo: 629105150921
J4 = Con_76: Conector par ICD; UID: Con_76; Name: TagConnect_6pol; mounting: SMD
L5 = WE-CBF 0603, 74279260: as L1 on sheet LarixEDUV3b; ComponentLink1Description: Manufacturer; ComponentLink1URL: http://www.we-online.de; Created by: Christin Zierenner; Created Date: May 2009; partNo: 74279260; ComponentLink2Description: Datasheet; ComponentLink2URL: http://www.we-online.de/katalog/media/pdf/74279260.pdf
P13 = Con_86: UID: Con_86; Name: Header_20X2; mounting: THD
Q2 = NX3225_2
R27-R35 = Res_5: Name: Res_0603; UID: Res_5; mounting: SMD
RPI1 = Misc_46: UID: Misc_46; Name: RPI_Zero; mounting: THT
U8 = XMC4200-Q48K256 AB: 80 MHz XMC4200 MCU with 256 KByte Program Memory, 40 KByte SRAM, 3.3 V, -40 to 125 degC, PG-VQFN-48, Green; Manufacturer: Infineon; A / D input lines (incl. FADC): 8; Digital I/O Lines: 21; Program Memory: 256.0 KByte; SRAM (incl. Cache): 40.0 KByte; Type of Serial I/O Interfaces: 4xSPI, Dual SPI, Quad SPI, UART, LIN, IIC, IIS; DatasheetVersion: V0.6; PackageVersion: V0.6; PackageReference: PG-VQFN-48-53; PackageDescription: 48-Pin Plastic (Green) Very Thin Profile Quad Flat Non Leaded Package, 7 x 7 mm Body, 0.5 mm Pitch; Halogen-free: TRUE; Mounting Technology: Surface Mount; PartNumber: XMC4200-Q48K256 AB; ComponentLink1Description: Manufacturer URL; ComponentLink1URL: http://www.infineon.com; ComponentLink2Description: Datasheet; ComponentLink2URL: http://www.infineon.com/dgdl/xmc4100_xmc4200_ds_v0.6_2012_11.pdf?folderId=db3a30433580b3710135a47f3eb76c98&fileId=db3a30433afc7e3e013b3cf9b2816573&location=en.Products.Microcontrollers.32-bit_Industrial_Microcontrollers_based_on_ARM__Cortex_-M.32-bit_XMC4000_Industrial_Microcontrollers_ARM__Cortex_-M4.DATASHEET.xmc4100_xmc4200_ds_v0.6_2012_11.pdf; ComponentLink3Description: Package Specification; ComponentLink3URL: http://www.infineon.com/dgdl/PG-VQFN-48-15%2C-19%2C-20%2C-22%2C-24%2C-48%2C-51%2C-52%2C-53%2C-54%2C-55%2C-56%2C-57-Package_Overview.pdf?folderId=db3a304319c6f18c0119e80a8f2559bf&fileId=db3a304319c6f18c011a0b8b18c33200

## Nets that join several sheets
+3V3: LarixEDUV3b (41 pins), LarixEDUV3b_1 (12 pins)
+5V: LarixEDUV3b (18 pins), LarixEDUV3b_1 (D12.1)
GND: LarixEDUV3b (81 pins), LarixEDUV3b_1 (46 pins)
NetC23_1: LarixEDUV3b (5 pins), LarixEDUV3b_1 (U8.47)
NetP3_2: LarixEDUV3b (P3.2 U3.66), LarixEDUV3b_1 (U8.35 U8.36)
NetP3_4: LarixEDUV3b (P3.4 U3.67), LarixEDUV3b_1 (U8.22 U8.39)
NetP3_6: LarixEDUV3b (P3.6 U3.51), LarixEDUV3b_1 (U8.2 U8.24)
NetP3_9: LarixEDUV3b (P3.9), LarixEDUV3b_1 (R30.2 U8.32)
NetP13_2: LarixEDUV3b (R9.2 U5.3), LarixEDUV3b_1 (P13.2 P13.4 RPI1.2 RPI1.4)
NetP13_3: LarixEDUV3b (R19.1 U3.58 U7.3 U10.5), LarixEDUV3b_1 (P13.3 RPI1.3)
NetP13_5: LarixEDUV3b (R18.1 U3.56 U7.4 U10.6), LarixEDUV3b_1 (P13.5 RPI1.5)
NetP13_8: LarixEDUV3b (U3.75), LarixEDUV3b_1 (P13.8 RPI1.8)
NetP13_10: LarixEDUV3b (U3.74), LarixEDUV3b_1 (P13.10 RPI1.10)
NetP13_18: LarixEDUV3b (U3.93), LarixEDUV3b_1 (P13.18 RPI1.18)
NetP13_19: LarixEDUV3b (U3.98), LarixEDUV3b_1 (P13.19 RPI1.19)
NetP13_21: LarixEDUV3b (U3.97), LarixEDUV3b_1 (P13.21 RPI1.21)
NetP13_22: LarixEDUV3b (U3.99), LarixEDUV3b_1 (P13.22 RPI1.22)
NetP13_23: LarixEDUV3b (U3.95), LarixEDUV3b_1 (P13.23 RPI1.23)
NetP13_24: LarixEDUV3b (U3.96), LarixEDUV3b_1 (P13.24 RPI1.24)
NetP13_29: LarixEDUV3b (U3.100), LarixEDUV3b_1 (P13.29 RPI1.29)
NetP13_31: LarixEDUV3b (U3.3), LarixEDUV3b_1 (P13.31 RPI1.31)
NetP13_33: LarixEDUV3b (U3.40), LarixEDUV3b_1 (P13.33 RPI1.33)
NetP13_35: LarixEDUV3b (U3.41), LarixEDUV3b_1 (P13.35 RPI1.35)
NetU3_1: LarixEDUV3b (U3.1), LarixEDUV3b_1 (U8.46)
NetU3_2: LarixEDUV3b (U3.2), LarixEDUV3b_1 (U8.45)